# Altium schematic sheet M12_Part_Left.SchDoc
size A3
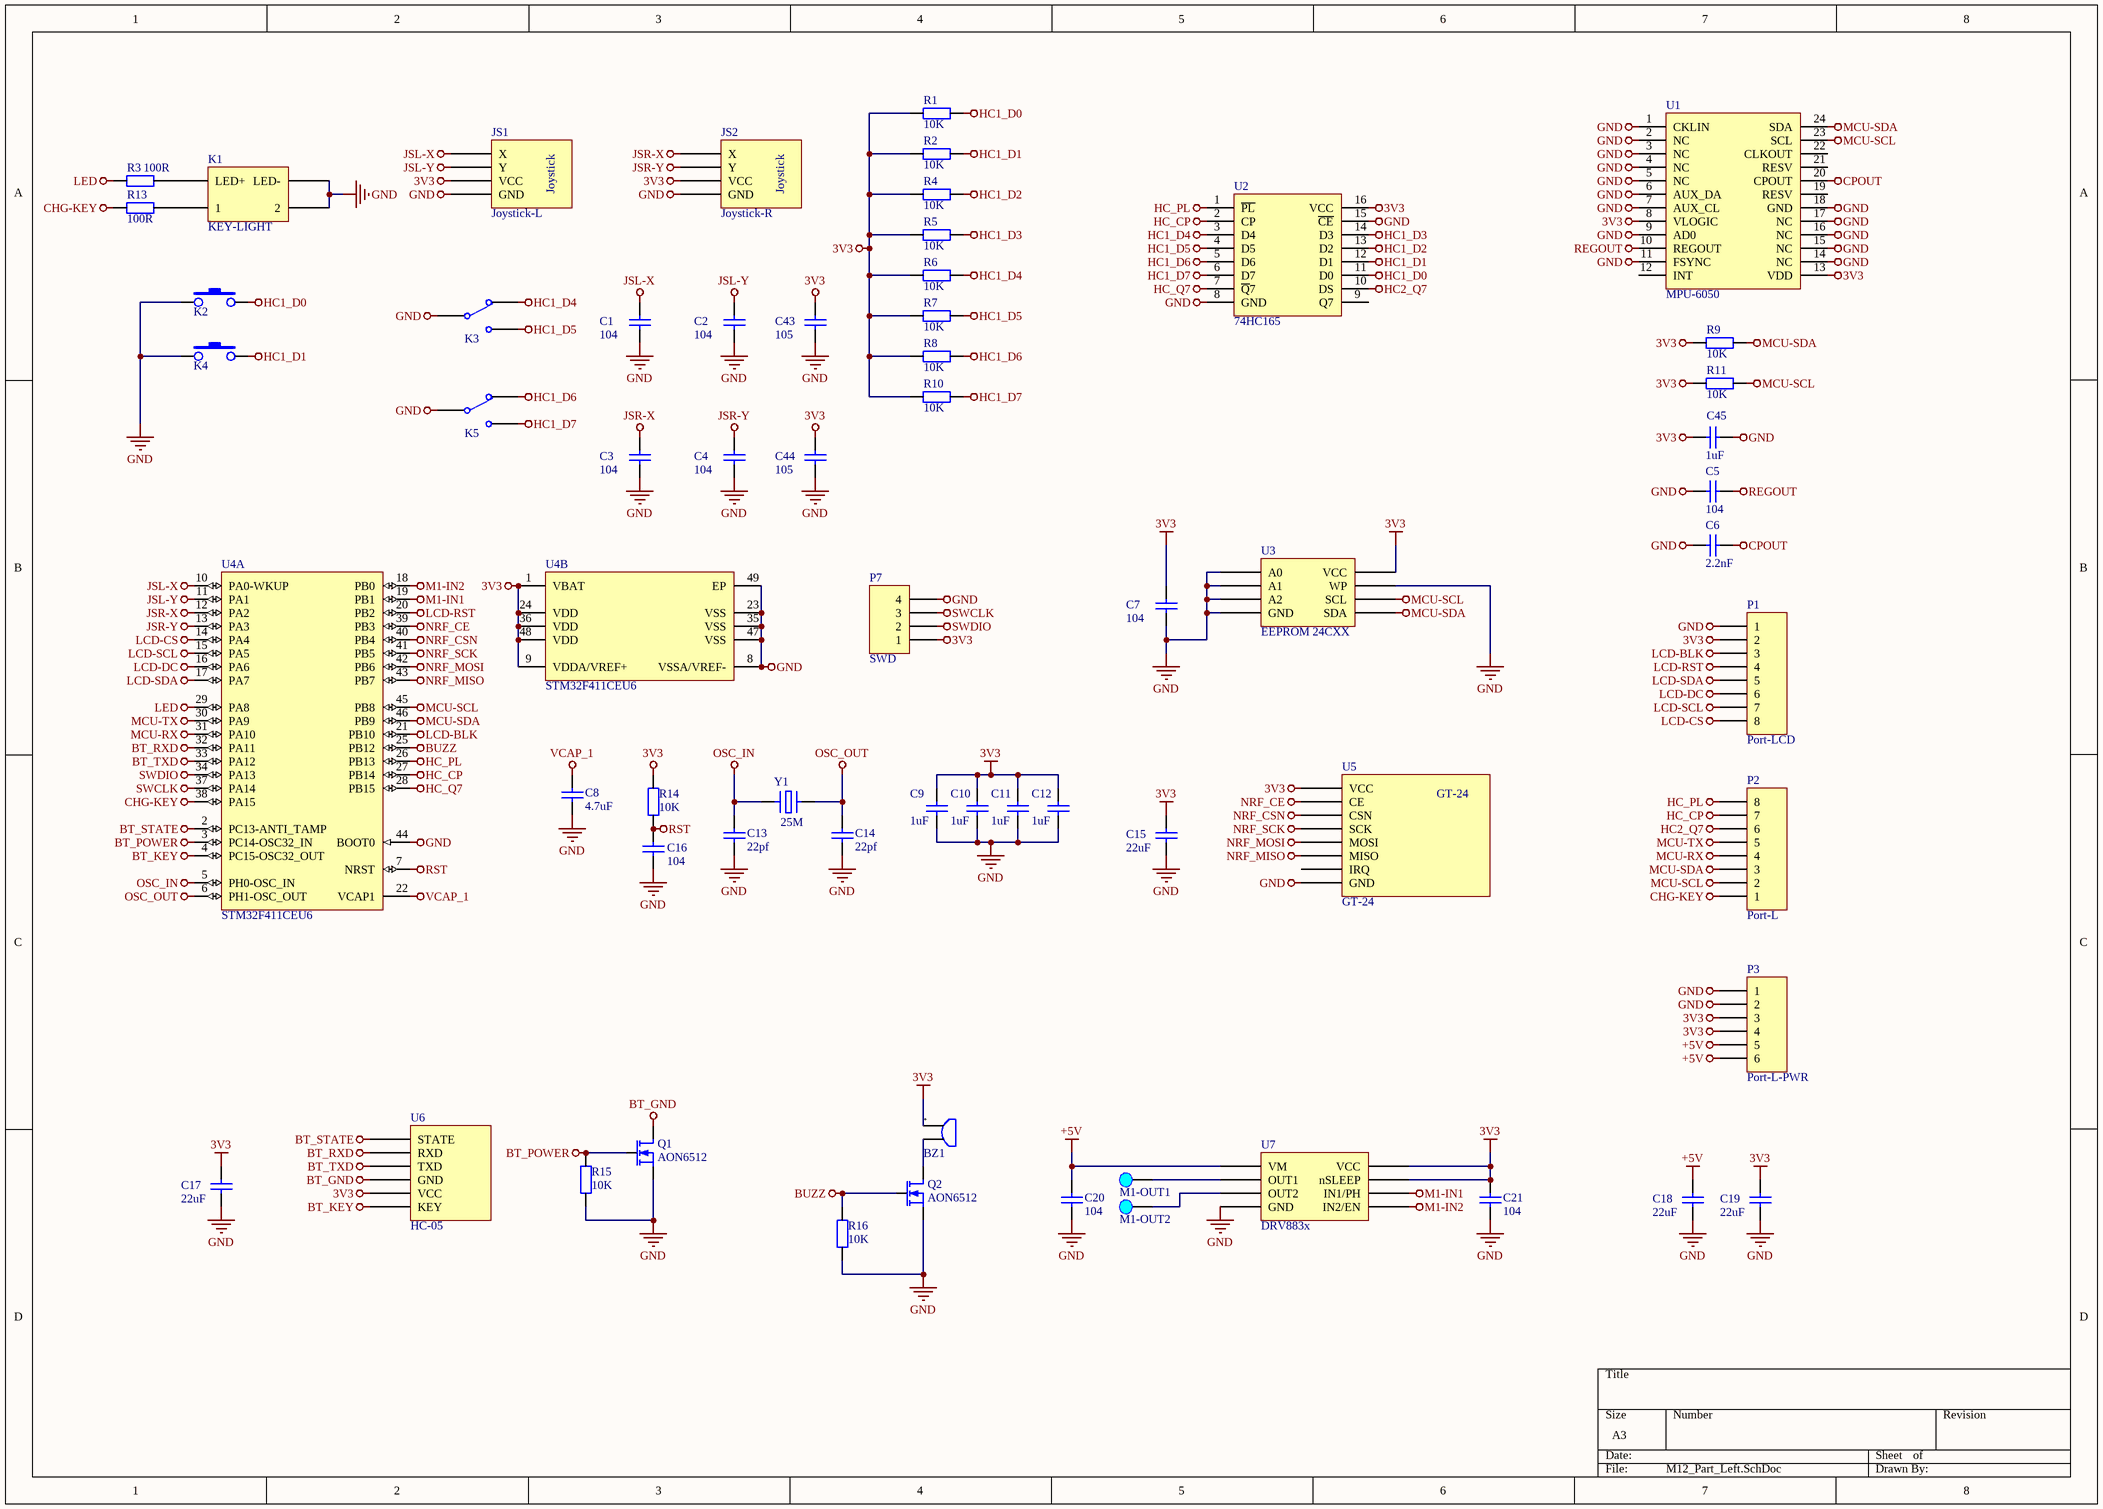
[diagram p0: M12_Part_Left.SchDoc]

## Parts
BZ1  蜂鸣器  [BUZ-SMD_4P-L7.5-W7.5-P7.59-BR]  (value not drawn)
C1  104  [电容_C0603]
C2  104  [电容_C0603]
C3  104  [电容_C0603]
C4  104  [电容_C0603]
C5  104  [电容_C0603]
C6  2.2nF  [电容_C0603]
C7  104  [电容_C0603]
C8  4.7uF  [电容_C0603]
C9  1uF  [电容_C0603]
C10  1uF  [电容_C0603]
C11  1uF  [电容_C0603]
C12  1uF  [电容_C0603]
C13  22pf  [电容_C0603]
C14  22pf  [电容_C0603]
C15  22uF  [电容_C1206]
C16  104  [电容_C0603]
C17  22uF  [电容_C1206]
C18  22uF  [电容_C1206]
C19  22uF  [电容_C1206]
C20  104  [电容_C0603]
C21  104  [电容_C0603]
C43  105  [电容_C0603]
C44  105  [电容_C0603]
C45  1uF  [电容_C0603]
JS1  Joystick-L  [ZH1.5-LS-4P]
JS2  Joystick-R  [ZH1.5-LS-4P]
K1  KEY-LIGHT  [SW-TH_4P-L12.0-W12.0-P5.00-LS12.5]
K2  SKRP  [KEY-SMD_4P-L6.0-W6.0-P3.90-LS10.0]  (value not drawn)
K3  *  [ZH1.5-WS-3P]  (value not drawn)
K4  SKRP  [KEY-SMD_4P-L6.0-W6.0-P3.90-LS10.0]  (value not drawn)
K5  *  [ZH1.5-WS-3P]  (value not drawn)
M1  M1-OUT1  [Pad_B]
M2  M1-OUT2  [Pad_B]
P1  Port-LCD  [ZH1.5-LS-8P]
P2  Port-L  [ZH1.5-WS-8P]
P3  Port-L-PWR  [ZH1.5-WS-6P]
P7  SWD  [HDR1X4]
Q1  AON6512  [MOS_SOT-23]
Q2  AON6512  [MOS_SOT-23]
R1  10K  [电阻_R0603]
R2  10K  [电阻_R0603]
R3  100R  [电阻_R0603]
R4  10K  [电阻_R0603]
R5  10K  [电阻_R0603]
R6  10K  [电阻_R0603]
R7  10K  [电阻_R0603]
R8  10K  [电阻_R0603]
R9  10K  [电阻_R0603]
R10  10K  [电阻_R0603]
R11  10K  [电阻_R0603]
R13  100R  [电阻_R0603]
R14  10K  [电阻_R0603]
R15  10K  [电阻_R0603]
R16  10K  [电阻_R0603]
U1  MPU-6050  [陀螺仪_QFN24]
U2  74HC165  [74HC系列_SOP16]
U3  EEPROM 24CXX  [SOP8]
U4  STM32F411CEU6  [STM-UFQFPN48_N]  (parts A,B of 2)
U5  GT-24  [GT-24]
U6  HC-05  [HDR1X6]
U7  DRV883x  [WSON-8_L2.0-W2.0-P0.50-TL-EP]
Y1  F: 25M  [晶振_3225]  (hidden comment: XTAL)

## Nets
3V3: BZ1.1 C7.2 C9.2 C10.2 C11.2 C12.2 C15.2 C17.2 C19.2 C21.2 C43.2 C44.2 C45.2 JS1.2(VCC) JS2.2(VCC) P1.2 P3.3 P3.4 P7.1 R1.1 R2.1 R4.1 R5.1 R6.1 R7.1 R8.1 R9.2 R10.1 R11.2 R14.2 U1.8(VLOGIC) U1.13(VDD) U2.16(VCC) U3.8(VCC) U4.1(VBAT) U4.9(VDDA/VREF+) U4.24(VDD) U4.36(VDD) U4.48(VDD) U5.1(VCC) U6.2(VCC) U7.7(nSLEEP) U7.8(VCC)
+5V: C18.2 C20.1 P3.5 P3.6 U7.1(VM)
BT_GND: Q1.2(D) U6.3(GND)
BT_KEY: U4.4(PC15-OSC32_OUT) U6.1(KEY)
BT_POWER: Q1.1(G) R15.2 U4.3(PC14-OSC32_IN)
BT_RXD: U4.32(PA11) U6.5(RXD)
BT_STATE: U4.2(PC13-ANTI_TAMP) U6.6(STATE)
BT_TXD: U4.33(PA12) U6.4(TXD)
BUZZ: Q2.1(G) R16.2 U4.25(PB12)
CHG-KEY: P2.1 R13.1 U4.38(PA15)
CPOUT: C6.1 U1.20(CPOUT)
GND: C1.1 C2.1 C3.1 C4.1 C5.2 C6.2 C7.1 C8.1 C9.1 C10.1 C11.1 C12.1 C13.2 C14.2 C15.1 C16.1 C17.1 C18.1 C19.1 C20.2 C21.1 C43.1 C44.1 C45.1 JS1.1(GND) JS2.1(GND) K1.2 K1.4(LED-) K2.1 K3.1 K4.1 K5.1 P1.1 P3.1 P3.2 P7.4 Q1.3(S) Q2.3(S) R15.1 R16.1 U1.1(CKLIN) U1.2(NC) U1.3(NC) U1.4(NC) U1.5(NC) U1.6(AUX_DA) U1.7(AUX_CL) U1.9(AD0) U1.11(FSYNC) U1.14(NC) U1.15(NC) U1.16(NC) U1.17(NC) U1.18(GND) U2.8(GND) U2.15(~{CE}) U3.1(A0) U3.2(A1) U3.3(A2) U3.4(GND) U3.7(WP) U4.8(VSSA/VREF-) U4.23(VSS) U4.35(VSS) U4.44(BOOT0) U4.47(VSS) U4.49(EP) U5.8(GND) U7.4(GND)
HC1_D0: K2.2 R1.2 U2.11(D0)
HC1_D1: K4.2 R2.2 U2.12(D1)
HC1_D2: R4.2 U2.13(D2)
HC1_D3: R5.2 U2.14(D3)
HC1_D4: K3.2 R6.2 U2.3(D4)
HC1_D5: K3.3 R7.2 U2.4(D5)
HC1_D6: K5.2 R8.2 U2.5(D6)
HC1_D7: K5.3 R10.2 U2.6(D7)
HC2_Q7: P2.6 U2.10(DS)
HC_CP: P2.7 U2.2(CP) U4.27(PB14)
HC_PL: P2.8 U2.1(~{PL}) U4.26(PB13)
HC_Q7: U2.7(~{Q}7) U4.28(PB15)
JSL-X: C1.2 JS1.4(X) U4.10(PA0-WKUP)
JSL-Y: C2.2 JS1.3(Y) U4.11(PA1)
JSR-X: C3.2 JS2.4(X) U4.12(PA2)
JSR-Y: C4.2 JS2.3(Y) U4.13(PA3)
LCD-BLK: P1.3 U4.21(PB10)
LCD-CS: P1.8 U4.14(PA4)
LCD-DC: P1.6 U4.16(PA6)
LCD-RST: P1.4 U4.20(PB2)
LCD-SCL: P1.7 U4.15(PA5)
LCD-SDA: P1.5 U4.17(PA7)
LED: R3.1 U4.29(PA8)
M1-IN1: U4.19(PB1) U7.6(IN1/PH)
M1-IN2: U4.18(PB0) U7.5(IN2/EN)
MCU-RX: P2.4 U4.31(PA10)
MCU-SCL: P2.2 R11.1 U1.23(SCL) U3.6(SCL) U4.45(PB8)
MCU-SDA: P2.3 R9.1 U1.24(SDA) U3.5(SDA) U4.46(PB9)
MCU-TX: P2.5 U4.30(PA9)
NRF_CE: U4.39(PB3) U5.2(CE)
NRF_CSN: U4.40(PB4) U5.3(CSN)
NRF_MISO: U4.43(PB7) U5.6(MISO)
NRF_MOSI: U4.42(PB6) U5.5(MOSI)
NRF_SCK: U4.41(PB5) U5.4(SCK)
OSC_IN: C13.1 U4.5(PH0-OSC_IN) Y1.1
OSC_OUT: C14.1 U4.6(PH1-OSC_OUT) Y1.2
REGOUT: C5.1 U1.10(REGOUT)
RST: C16.2 R14.1 U4.7(NRST)
SWCLK: P7.3 U4.37(PA14)
SWDIO: P7.2 U4.34(PA13)
VCAP_1: C8.2 U4.22(VCAP1)
NetBZ1_2: BZ1.2 Q2.2(D)
NetK1_1: K1.1 R13.2
NetK1_3: K1.3(LED+) R3.2
NetM1_1: M1.1 U7.2(OUT1)
NetM2_1: M2.1 U7.3(OUT2)

Not connected (* = marked no-connect by the designer): U1 0 12(INT) 19(RESV) 21(RESV) 22(CLKOUT); U2 9(Q7); U5 7(IRQ)

## Notes on the sheet
- (in symbol BZ) +

## Library data of the parts
BZ1 = BZ
C1-C21 C43-C45 = cap: U: 50V; 参数: Cap,0805,X7R,104K,50V,125C,±10%
  C1-C5 C7 C16 C20 C21: C: 104
  C6: C: 2.2nF
  C8: C: 4.7uF
  C9-C12 C45: C: 1uF
  C13 C14: C: 22pf
  C15 C17-C19: C: 22uF
  C43 C44: C: 105
JS1 JS2 = Joystick
K2 K4 = SW-PB: _Comma: ,; _Name: KEY; _Specification: KEY,SKRP,*; _Footprint: *; _Model: SKRP
K3 K5 = KEY-3: pin to pad: 1>2 2>1; _Comma: ,; _Footprint: KEY-3*6; _Name: Switch; _Specification: Switch,*,KEY-3*6; _Model: *
M1 = Pad: _Funcyusa: Test; _Specification: Pad,Test,M1-OUT1; _Comma: ,; _Name: Pad; _Remarks: M1-OUT1
M2 = Pad: _Funcyusa: Test; _Specification: Pad,Test,M1-OUT2; _Comma: ,; _Name: Pad; _Remarks: M1-OUT2
P1 P2 = Header 8: Header, 8-Pin; LatestRevisionDate: 17-Jul-2002; LatestRevisionNote: Re-released for DXP Platform.; Publisher: Altium Limited
P3 = Header 6: Header, 6-Pin; LatestRevisionDate: 17-Jul-2002; LatestRevisionNote: Re-released for DXP Platform.; Publisher: Altium Limited
P7 = Header 4: Header, 4-Pin; LatestRevisionDate: 17-Jul-2002; LatestRevisionNote: Re-released for DXP Platform.; Publisher: Altium Limited
Q1 Q2 = MOSFET-N: 参数: N-MOSFET,DFN5*6,AON6512,30V,150A
R1-R11 R13-R16 = Res: P: 1/8W; 参数: Res,0805,0R,±1%,1/8W,100ppm,155C
  R1 R2 R4-R11 R14-R16: R: 10K
  R3 R13: R: 100R
U3 = EEPROM 24CXX: 24CXX
U4 = STM32F401CCU6: ARM Cortex-M4 32-bit MCU+FPU, 105 DMIPS, 256 kB Flash, 64 kB Internal RAM, 36 I/Os, 48-pin UFQFPN, -40 to 85 degC, Tray; Manufacturer: STMicroelectronics; FLASH Size (Prog) (kB): 256; I/Os (High Current): 36; Internal RAM Size (kB): 64; Operating Frequency(F) (Processor speed) (MHz): 84; Supply Voltage(Vcc) max (V): 3.6; Supply Voltage(Vcc) min (V): 1.8; DatasheetVersion: Rev. 1; PackageVersion: Rev. 1, 04/2013; PackageReference: UFQFPN48; PackageDescription: 48-Pin Ultra Thin Fine Pitch Quad Flat No-Lead, 7 x 7 x 0.6 mm Body, 0.5 mm Pitch, Exposed Pad; Supplier 1: Newark; Supplier Part Number 1: 19X6217; Supplier 2: Mouser; Supplier Part Number 2: 511-STM32F401CCU6; Core: ARM Cortex-M4; Packing: Tray; Mounting Technology: Surface Mount; PartNumber: STM32F401CCU6; ComponentLink1Description: Manufacturer URL; ComponentLink1URL: http://www.st.com/web/en/home.html; ComponentLink2Description: Datasheet; ComponentLink2URL: http://www.st.com/st-web-ui/static/active/en/resource/technical/document/data_brief/DM00071938.pdf; ComponentLink3Description: Package Specification; ComponentLink3URL: http://www.st.com/st-web-ui/static/active/en/resource/technical/document/data_brief/DM00071938.pdf
U5 = GT-24: NRF24L01
U6 = HC-05: Bluetooth